# Altium schematic sheet InterfaceAndControl.SchDoc
size 420 x 297 mm; Address1: Address1; Address2: Address2; Address3: Address3; Address4: Address4; DocumentNumber: АБВГ.123456.001 Э3; SheetNumber: 3; SheetTotal: 3; Scale: 1:1; DocumentType: Схема электрическая принципиальная; FirstReferrence: АБВГ.123456.001
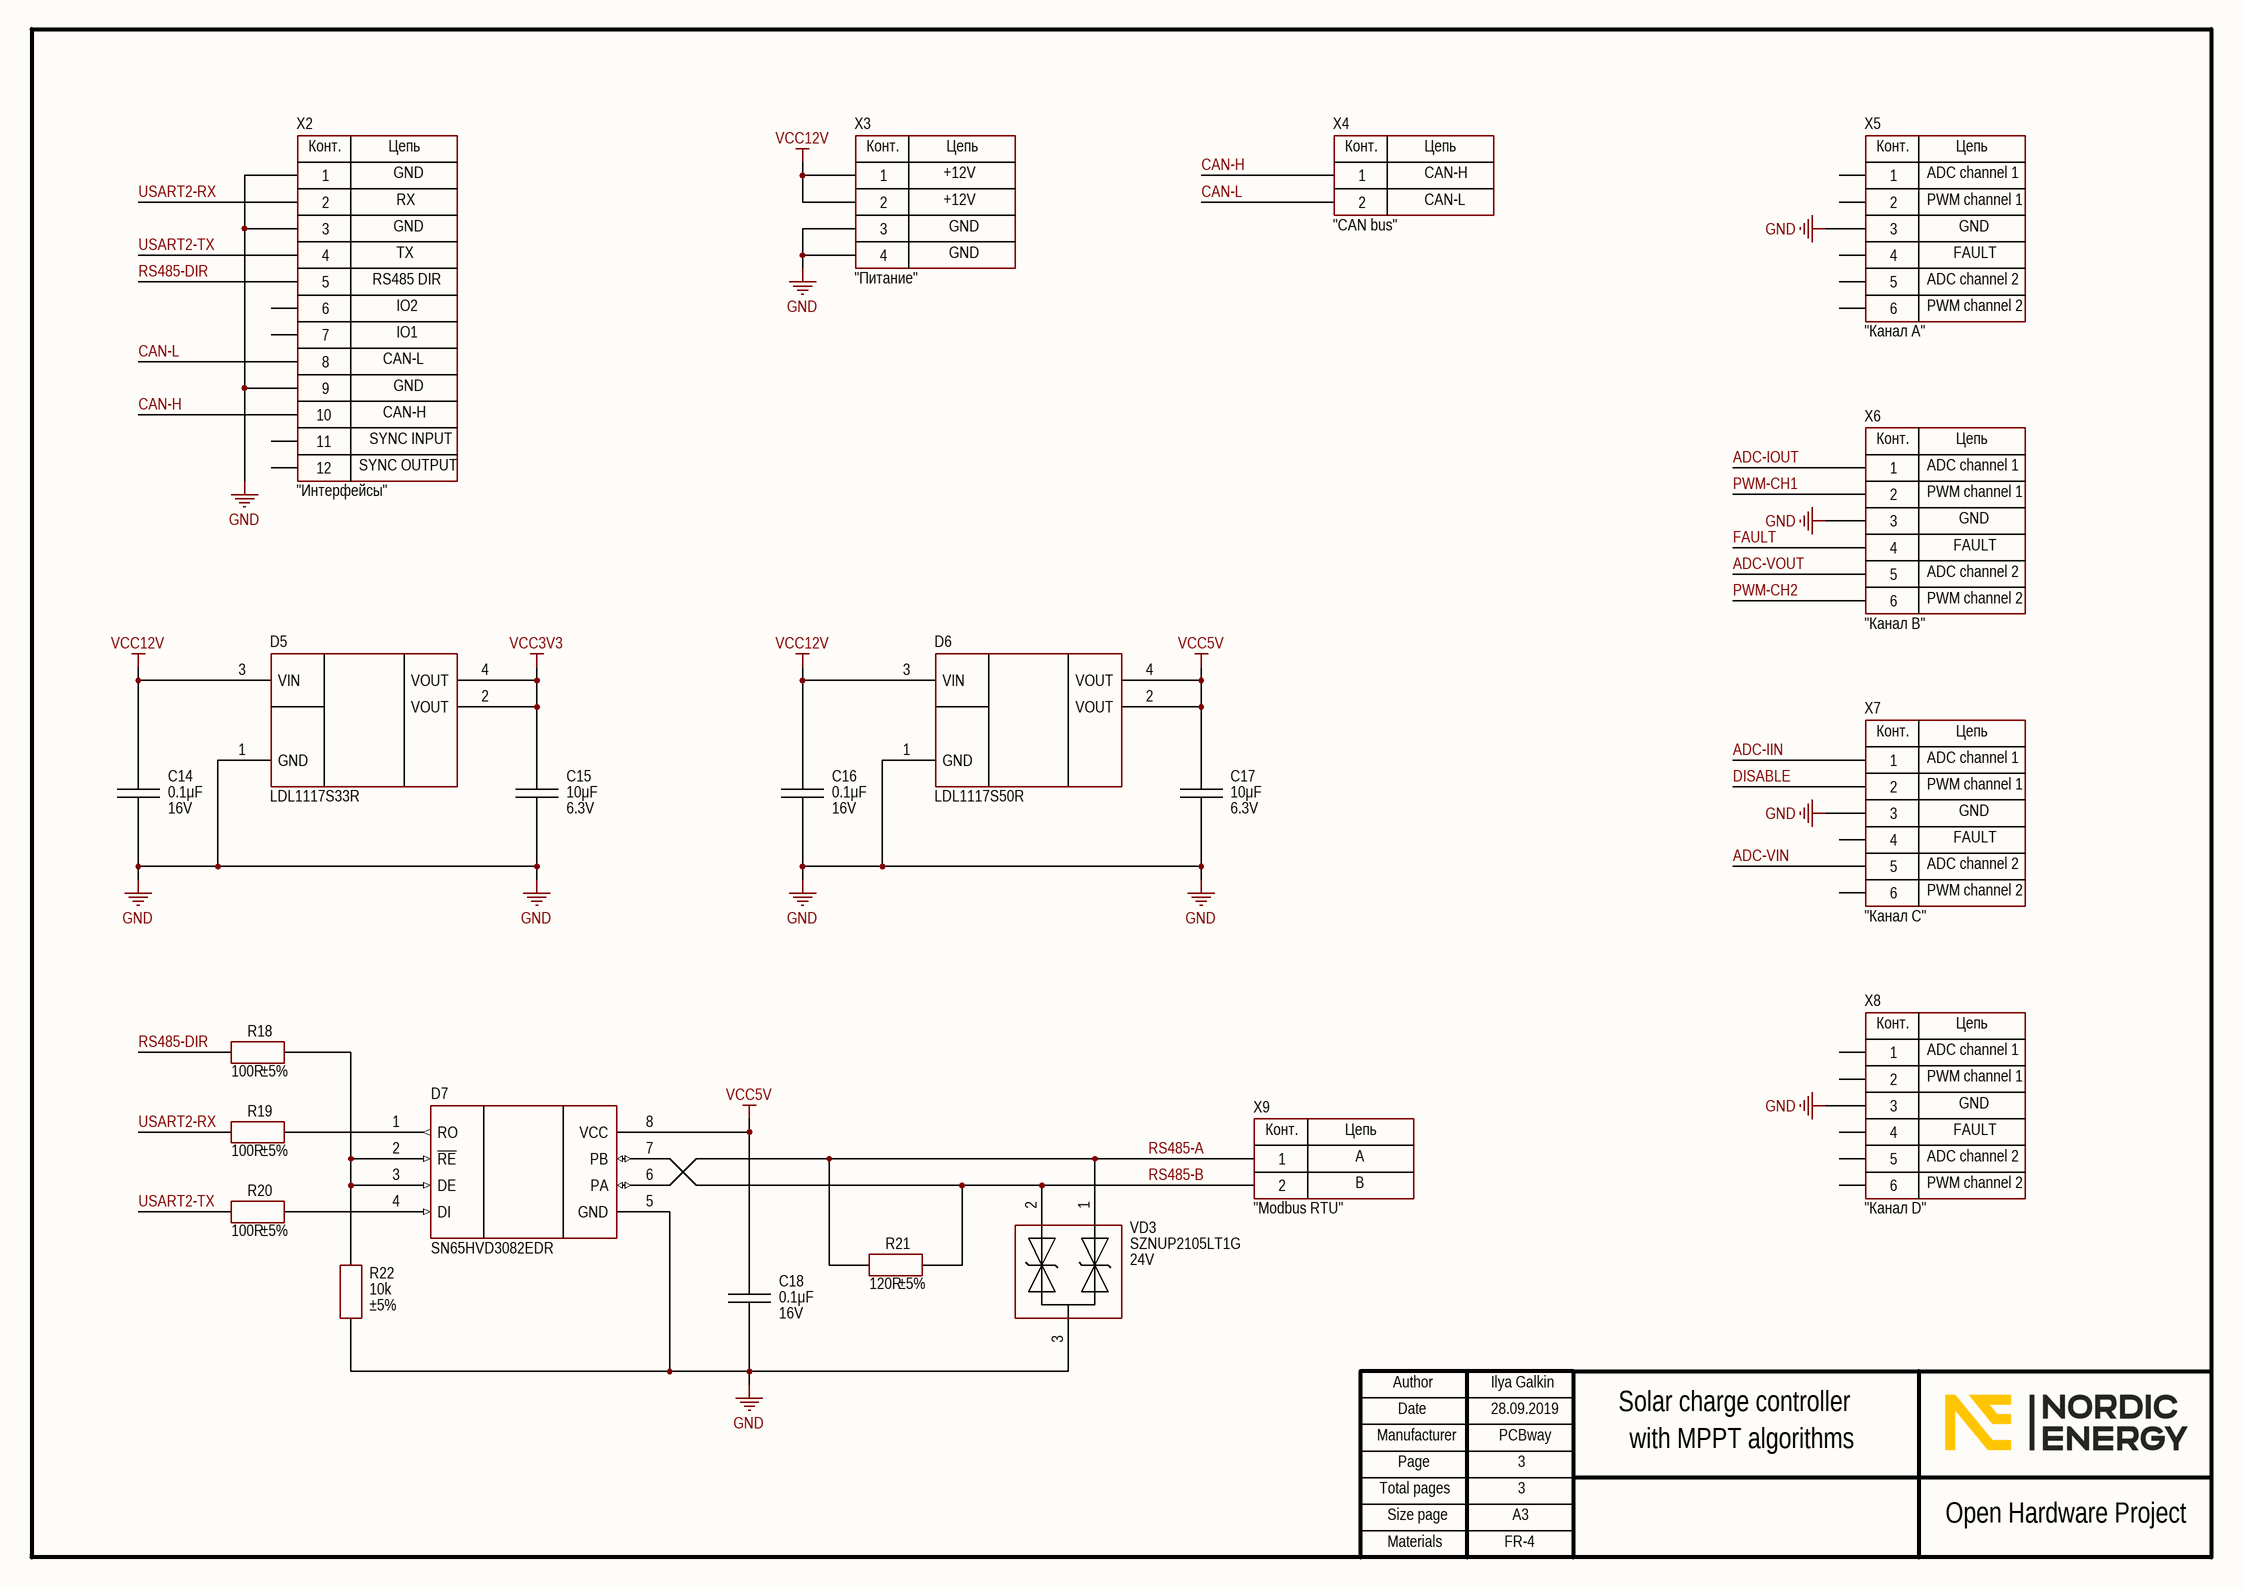
[diagram p0: InterfaceAndControl.SchDoc]

## Parts
C14  value 0.1μF  Voltage: 16V  [CAP: 0805]
C15  value 10μF  Voltage: 6.3V  [CAP: 0805]
C16  value 0.1μF  Voltage: 16V  [CAP: 0805]
C17  value 10μF  Voltage: 6.3V  [CAP: 0805]
C18  value 0.1μF  Voltage: 16V  [CAP: 0805]
D5  (no value)  [SOT223]
D6  PartNumber: LDL1117S50R  [SOT223]
D7  (no value)  [8-SOIC]
R18  value 100R  Tolerance: ±5%  [RES: 0805]
R19  value 100R  Tolerance: ±5%  [RES: 0805]
R20  value 100R  Tolerance: ±5%  [RES: 0805]
R21  value 120R  Tolerance: ±5%  [RES: 0805]
R22  value 10k  Tolerance: ±5%  [RES: 0805]
VD3  Voltage: 24V  PartNumber: SZNUP2105LT1G  [SOT23]
X2  CommentText: "Интерфейсы"  [CON: PBD-12]
X3  CommentText: "Питание"  [CON: PBD-4]
X4  CommentText: "CAN bus"  [CON: DG350-3.5-02P]
X5  CommentText: "Канал А"  [CON: PBD-6]
X6  CommentText: "Канал В"  [CON: PBD-6]
X7  CommentText: "Канал С"  [CON: PBD-6]
X8  CommentText: "Канал D"  [CON: PBD-6]
X9  CommentText: "Modbus RTU"  [CON: DG350-3.5-02P]

## Nets
GND: C14.1 C15.1 C16.1 C17.1 C18.1 D5.1(GND) D6.1(GND) D7.5(GND) R22.2 VD3.3 X2.1 X2.3 X2.9 X3.3 X3.4 X5.3 X6.3 X7.3 X8.3
VCC3V3: C15.2 D5.2(VOUT) D5.4(VOUT)
VCC5V: C17.2 C18.2 D6.2(VOUT) D6.4(VOUT) D7.8(VCC)
VCC12V: C14.2 C16.2 D5.3(VIN) D6.3(VIN) X3.1 X3.2
ADC-IIN: X7.1
ADC-IOUT: X6.1
ADC-VIN: X7.5
ADC-VOUT: X6.5
CAN-H: X2.10 X4.1
CAN-L: X2.8 X4.2
DISABLE: X7.2
FAULT: X6.4
PWM-CH1: X6.2
PWM-CH2: X6.6
RS485-A: D7.6(PA) R21.1 VD3.1 X9.1
RS485-B: D7.7(PB) R21.2 VD3.2 X9.2
RS485-DIR: R18.1 X2.5
USART2-RX: R19.1 X2.2
USART2-TX: R20.1 X2.4
NetD7_1: D7.1(RO) R19.2
NetD7_2: D7.2(~{RE}) D7.3(DE) R18.2 R22.1
NetD7_4: D7.4(DI) R20.2

Not connected (* = marked no-connect by the designer): X2 6 7 11 12; X5 1 2 4 5 6; X7 4 6; X8 1 2 4 5 6

## Notes on the sheet
- GND
- +12V
- CAN-H
- ADC channel 1
- TX
- RX
- CAN-L
- PWM channel 1
- FAULT
- RS485 DIR
- IO2
- ADC channel 2
- PWM channel 2
- IO1
- SYNC INPUT
- SYNC OUTPUT
- B
- A
- Ilya Galkin
- 28.09.2019
- PCBway
- 3
- Solar charge controller
- with MPPT algorithms
- FR-4
- Author
- Manufacturer
- Date
- Page
- Total pages
- Size page
- A3
- Open Hardware Project
- Materials
- (in symbol Connector_terminal_2pin) Конт.; Цепь
- (in symbol PBD-4) Конт.; Цепь
- (in symbol PBD-6) Конт.; Цепь
- (in symbol PBD-12) Конт.; Цепь

## Library data of the parts
C14 C16 C18 = Ceramic_0805: Manufacturer: Yageo; PartNumber: CC0805KRX7R7BB104; ValueManufacturerPartNumber: Ceramic capacitor, 0.1μF, X7R, ±10%, 16V, 0805, -55...+125°C; TypeCapacitor: Ceramic capacitor; Tolerance: ±10%; TypeDielectric: X7R; Package: 0805; HelpURL: https://www.digikey.com/product-detail/en/yageo/CC0805KRX7R7BB104/311-1142-1-ND/303052; Temperature: -55...+125°C
C15 C17 = Ceramic_0805: Manufacturer: Samsung; PartNumber: CL21B106KQQNNNE; ValueManufacturerPartNumber: Ceramic capacitor, 10μF, X7R, ±10%, 6.3V, 0805, -55...+125°C; TypeCapacitor: Ceramic capacitor; Tolerance: ±10%; TypeDielectric: X7R; Package: 0805; HelpURL: https://www.digikey.com/product-detail/en/samsung-electro-mechanics/CL21B106KQQNNNE/1276-1113-1-ND/3889199; Temperature: -55...+125°C
D5 = LDL1117S33R: Linear voltage regulator; Manufacturer: STMicroelectronics; ValueManufacturerPartNumber: Linear voltage regulator, input 3.9...18V, 0.6V, output 3.3V, 1.2A, -40...+85°C, SOT223; VoltageInput: input 3.9...18V; MaxDropout: 0.6V; CurrentOutput: 1.2A; VoltageOutput: output 3.3V; HelpURL: https://www.digikey.com/product-detail/en/stmicroelectronics/LDL1117S33R/497-17239-1-ND/7102079; Package: SOT223; ComponentType: Linear voltage regulator; Temperature: -40...+85°C; PartNumber: LDL1117S33R
D6 = LDL1117S33R: Linear voltage regulator; Manufacturer: STMicroelectronics; ValueManufacturerPartNumber: Linear voltage regulator, input 5.6...18V, 0.6V, output 5V, 1.2A, -40...+85°C, SOT-223; VoltageInput: input 5.6...18V; MaxDropout: 0.6V; CurrentOutput: 1.2A; VoltageOutput: output 5V; HelpURL: https://www.digikey.com/product-detail/en/stmicroelectronics/LDL1117S50R/497-17240-6-ND/7102088; Package: SOT-223; ComponentType: Linear voltage regulator; Temperature: -40...+85°C
D7 = SN65HVD3082EDR: RS485; Manufacturer: Texas Instruments; ValueManufacturerPartNumber: IC RS485 transceiver, 200 kbps, Half-duplex, 4.5...5.5V, -40...+85°C, 8-SOIC; Supply: 4.5...5.5V; DataRate: 200 kbps; TypeDuplex: Half-duplex; HelpURL: https://www.digikey.com/product-detail/en/texas-instruments/SN65HVD3082EDR/296-31719-1-ND/3505195; Package: 8-SOIC; ComponentType: IC RS485 transceiver; Temperature: -40...+85°C; PartNumber: SN65HVD3082EDR
R18-R20 = Resistor_0805: Manufacturer: Yageo; PartNumber: RC0805JR-07100RL; ValueManufacturerPartNumber: Resistor film, 100R, ±5%, 0805, 0.125W, -55...+125°C; TypeResistor: Resistor film; Power: 0.125W; Package: 0805; HelpURL: https://www.digikey.com/product-detail/en/yageo/RC0805JR-07100RL/311-100ARCT-ND/731185; Temperature: -55...+125°C
R21 = Resistor_0805: Manufacturer: Yageo; PartNumber: RC0805JR-07120RL; ValueManufacturerPartNumber: Resistor film, 120R, ±5%, 0805, 0.125W, -55...+125°C; TypeResistor: Resistor film; Power: 0.125W; Package: 0805; HelpURL: https://www.digikey.com/product-detail/en/yageo/RC0805JR-07120RL/311-120ARCT-ND/731194; Temperature: -55...+125°C
R22 = Resistor_0805: Manufacturer: Yageo; PartNumber: RC0805JR-0710KL; ValueManufacturerPartNumber: Resistor film, 10k, ±5%, 0805, 0.125W, -55...+125°C; TypeResistor: Resistor film; Power: 0.125W; Package: 0805; HelpURL: https://www.digikey.com/product-detail/en/yageo/RC0805JR-0710KL/311-10KARCT-ND/731188; Temperature: -55...+125°C
VD3 = TVS_array: Manufacturer: ON Semiconductor; ValueManufacturerPartNumber: TVS diode, 24V, 350W peak, 0.9V, 30pF, SOT-23, -55...+150°C; TypeDiode: TVS diode; Current: 350W peak; VoltageDrop: 0.9V; RecoveryTime: 30pF; Package: SOT-23; HelpURL: https://www.digikey.com/product-detail/en/on-semiconductor/SZNUP2105LT1G/SZNUP2105LT1GOSCT-ND/3487669; Temperature: -55...+150°C
X2 = PBD-12: Manufacturer: Connfly; ValueManufacturerPartNumber: Connector, 12pin, 2.54mm, 500VAC, 3A; TypeConnector: Connector; VoltageMax: 500VAC; Pitch: 2.54mm; CurrentMax: 3A; Multichannel: 12pin; HelpURL: https://www.chipdip.ru/product/pbd-12; PartNumber: PBD-12
X3 = PBD-4: Manufacturer: Connfly; ValueManufacturerPartNumber: Connector, 4pin, 2.54mm, 500VAC, 3A; TypeConnector: Connector; VoltageMax: 500VAC; Pitch: 2.54mm; CurrentMax: 3A; Multichannel: 4pin; HelpURL: https://www.chipdip.ru/product/pbd-4; PartNumber: PBD-4
X4 X9 = Connector_terminal_2pin: Manufacturer: Degson; ValueManufacturerPartNumber: Terminal connector, 2pin, 3.5mm, 300VAC, 10A; PartNumber: DG350-3.5-02P-14; TypeConnector: Terminal connector; VoltageMax: 300VAC; Pitch: 3.5mm; CurrentMax: 10A; Multichannel: 2pin; HelpURL: https://www.chipdip.ru/product/dg350-3.5-02p-12
X5-X8 = PBD-6: Manufacturer: Connfly; ValueManufacturerPartNumber: Connector, 6pin, 2.54mm, 500VAC, 3A; TypeConnector: Connector; VoltageMax: 500VAC; Pitch: 2.54mm; CurrentMax: 3A; Multichannel: 6pin; HelpURL: https://www.chipdip.ru/product/pbd-6; PartNumber: PBD-6